# Altium project apogee_detection_board.PrjPcb
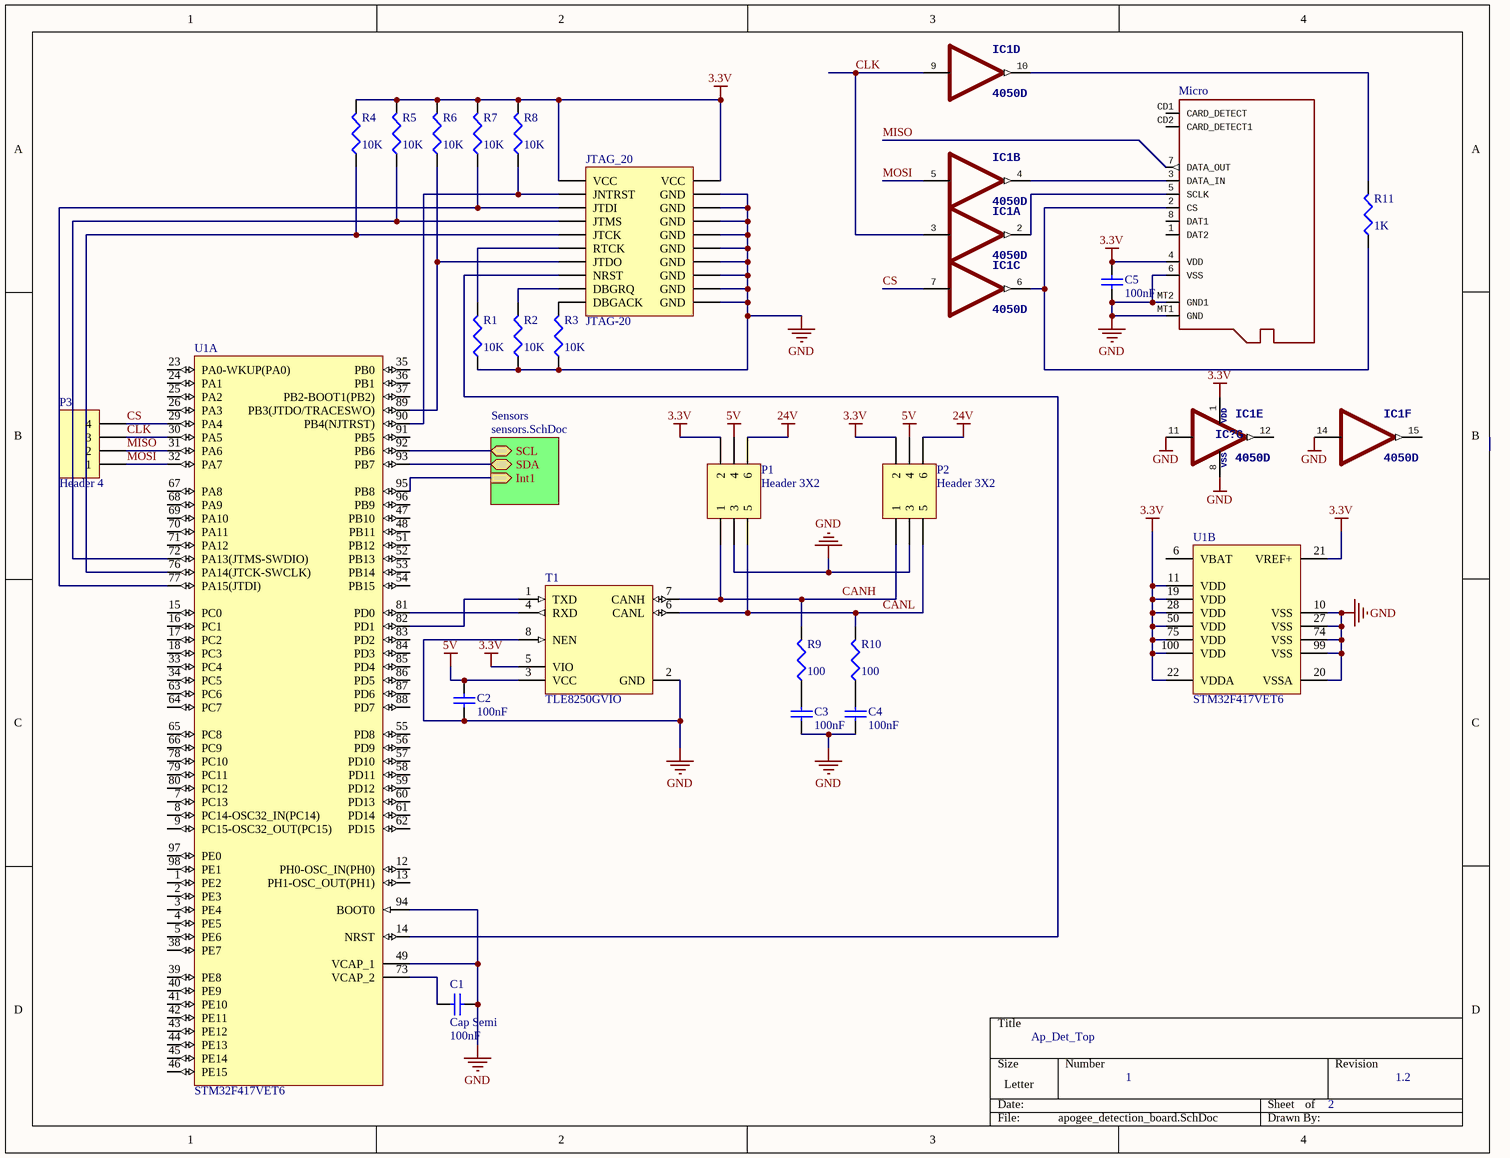
[diagram p0: apogee_detection_board.SchDoc]
2 sheets, 30 parts. Net scope: hierarchical (ports join the sheet entries above them; power ports are global).
Board file: ApDet.PcbDoc
Sheets:
  apogee_detection_board.SchDoc
    Sensors = sensors.SchDoc

## Sheet apogee_detection_board.SchDoc: Ap_Det_Top
size Letter; Revision: 1.2; SheetNumber: 1; SheetTotal: 2; ProjectName: Apogee_Detect

### Parts
C1  Cap Semi  value 100nF  [C1206]
C2  value 100nF  [C1206]  (hidden comment: Cap Semi)
C3  value 100nF  [C1206]  (hidden comment: Cap Semi)
C4  value 100nF  [C1206]  (hidden comment: Cap Semi)
C5  value 100nF  [C1206]  (hidden comment: Cap Semi)
IC1  4050D  [SO16]  (parts A,B,C,D,E,F of 7)
IC?  4050D  [SO16]  (part G of 7)
JTAG_20  JTAG-20  [PCBComponent_1]
Micro  (no value)  [MICROSD]
P1  Header 3X2  [HDR2X3]
P2  Header 3X2  [HDR2X3]
P3  Header 4  [HDR1X4]
R1  value 10K  [J1-0603]  (hidden comment: RTCK PD)
R2  value 10K  [J1-0603]  (hidden comment: DBGRQ PD)
R3  value 10K  [J1-0603]  (hidden comment: DBGACK PD)
R4  value 10K  [J1-0603]  (hidden comment: RTCK PD)
R5  value 10K  [J1-0603]  (hidden comment: RTCK PD)
R6  value 10K  [J1-0603]  (hidden comment: RTCK PD)
R7  value 10K  [J1-0603]  (hidden comment: RTCK PD)
R8  value 10K  [J1-0603]  (hidden comment: RTCK PD)
R9  value 100  [J1-0603]  (hidden comment: DBGACK PD)
R10  value 100  [J1-0603]  (hidden comment: DBGACK PD)
R11  value 1K  [J1-0603]  (hidden comment: DBGRQ PD)
T1  TLE8250GVIO  [INF-PG-DSO-8-16_N]
U1  STM32F417VET6  [STM-LQFP100_N]  (parts A,B of 2)

### Sub-sheets
Sensors = sensors.SchDoc: SCL (bidir), SDA (bidir), Int1 (in)

### Nets
3.3V: C5.2 IC?.1(VDD) JTAG_20.1(VCC) JTAG_20.2(VCC) Micro.4(VDD) P1.2 P2.2 R4.2 R5.2 R6.2 R7.2 R8.2 T1.5(VIO) U1.11(VDD) U1.19(VDD) U1.21(VREF+) U1.22(VDDA) U1.28(VDD) U1.50(VDD) U1.75(VDD) U1.100(VDD)
5V: C2.2 P1.4 P2.4 T1.3(VCC)
24V: P1.6 P2.6
GND: C1.2 C2.1 C3.1 C4.1 C5.1 IC1.11(I) IC1.14(I) IC?.8(VSS) JTAG_20.4(GND) JTAG_20.6(GND) JTAG_20.8(GND) JTAG_20.10(GND) JTAG_20.12(GND) JTAG_20.14(GND) JTAG_20.16(GND) JTAG_20.18(GND) JTAG_20.20(GND) Micro.6(VSS) Micro.MT1(GND) Micro.MT2(GND1) P1.3 P2.3 R1.1 R2.1 R3.1 T1.2(GND) T1.8(NEN) U1.10(VSS) U1.20(VSSA) U1.27(VSS) U1.49(VCAP_1) U1.74(VSS) U1.94(BOOT0) U1.99(VSS)
CANH: P1.1 P2.1 R9.2 T1.7(CANH)
CANL: P1.5 P2.5 R10.2 T1.6(CANL)
CLK: IC1.3(I) IC1.9(I) P3.3 U1.30(PA5)
CS: IC1.7(I) P3.4 U1.29(PA4)
MISO: Micro.7(DATA_OUT) P3.2 U1.31(PA6)
MOSI: IC1.5(I) P3.1 U1.32(PA7)
SCL: U1.92(PB6) ; sheet Sensors/SCL
SDA: U1.93(PB7) ; sheet Sensors/SDA
NetA1_11: U1.95(PB8) ; sheet Sensors/Int1
NetC1_1: C1.1 U1.73(VCAP_2)
NetC3_2: C3.2 R9.1
NetC4_2: C4.2 R10.1
NetIC1_2: IC1.2(O) Micro.5(SCLK)
NetIC1_4: IC1.4(O) Micro.3(DATA_IN)
NetIC1_6: IC1.6(O) Micro.2(CS) R11.1
NetIC1_10: IC1.10(O) R11.2
NetJTAG_20_3: JTAG_20.3(JNTRST) R8.1 U1.90(PB4(NJTRST))
NetJTAG_20_5: JTAG_20.5(JTDI) R7.1 U1.77(PA15(JTDI))
NetJTAG_20_7: JTAG_20.7(JTMS) R5.1 U1.72(PA13(JTMS-SWDIO))
NetJTAG_20_9: JTAG_20.9(JTCK) R4.1 U1.76(PA14(JTCK-SWCLK))
NetJTAG_20_11: JTAG_20.11(RTCK) R1.2
NetJTAG_20_13: JTAG_20.13(JTDO) R6.1 U1.89(PB3(JTDO/TRACESWO))
NetJTAG_20_15: JTAG_20.15(NRST) U1.14(NRST)
NetJTAG_20_17: JTAG_20.17(DBGRQ) R2.2
NetJTAG_20_19: JTAG_20.19(DBGACK) R3.2
NetT1_1: T1.1(TXD) U1.82(PD1)
NetT1_4: T1.4(RXD) U1.81(PD0)

Not connected (* = marked no-connect by the designer): IC1 12(O) 15(O); Micro 1(DAT2) 8(DAT1) CD1(CARD_DETECT) CD2(CARD_DETECT1); U1 1(PE2) 2(PE3) 3(PE4) 4(PE5) 5(PE6) 6(VBAT) 7(PC13) 8(PC14-OSC32_IN(PC14)) 9(PC15-OSC32_OUT(PC15)) 12(PH0-OSC_IN(PH0)) 13(PH1-OSC_OUT(PH1)) 15(PC0) 16(PC1) 17(PC2) 18(PC3) 23(PA0-WKUP(PA0)) 24(PA1) 25(PA2) 26(PA3) 33(PC4) 34(PC5) 35(PB0) 36(PB1) 37(PB2-BOOT1(PB2)) 38(PE7) 39(PE8) 40(PE9) 41(PE10) 42(PE11) 43(PE12) 44(PE13) 45(PE14) 46(PE15) 47(PB10) 48(PB11) 51(PB12) 52(PB13) 53(PB14) 54(PB15) 55(PD8) 56(PD9) 57(PD10) 58(PD11) 59(PD12) 60(PD13) 61(PD14) 62(PD15) 63(PC6) 64(PC7) 65(PC8) 66(PC9) 67(PA8) 68(PA9) 69(PA10) 70(PA11) 71(PA12) 78(PC10) 79(PC11) 80(PC12) 83(PD2) 84(PD3) 85(PD4) 86(PD5) 87(PD6) 88(PD7) 91(PB5) 96(PB9) 97(PE0) 98(PE1)

### Library data of the parts
C1-C5 = Cap Semi: Capacitor (Semiconductor SIM Model); Published: 8-Jun-2000; LatestRevisionDate: 29-May-2009; LatestRevisionNote: IPC-7351 Footprint Added.; PackageReference: C1206; Publisher: Altium Limited; PackageDescription: Chip Capacitor
IC1 IC? = 4050D: Hex non-inverting BUFFER
  IC?: VDD: VDD; VSS: VSS
JTAG_20 = HEADER 10X2: 20-pin JTAG header
Micro = MICROSD
P1 P2 = Header 3X2: Header, 3-Pin, Dual row; LatestRevisionDate: 17-Jul-2002; LatestRevisionNote: Re-released for DXP Platform.; Publisher: Altium Limited
P3 = Header 4: Header, 4-Pin; LatestRevisionDate: 17-Jul-2002; LatestRevisionNote: Re-released for DXP Platform.; Publisher: Altium Limited
R1-R11 = Res3: Resistor; Published: 8-Jun-2000; LatestRevisionDate: 29-May-2009; LatestRevisionNote: IPC-7351 Footprint Added.; PackageReference: J1-0603; Publisher: Altium Limited; PackageDescription: Chip Resistor
T1 = TLE8250GVIO: High Speed CAN-Transceiver, 1 Mbit/s Transmission Rate, PG-DSO-8-16, Reel, Green; Manufacturer: Infineon; Bus Wake-up capability: FALSE; Green: TRUE; Quiescent Current (max.): < 15 uA @ 5V standby; Standards: ISO11898-2; Wake-up inputs: no; DatasheetVersion: Rev. 1.0; PackageVersion: Mar-07; PackageReference: PG-DSO-8-16; PackageDescription: 8-Pin Plastic (Green) Dual Small Outline Package, 4.9 x 3.9 mm Body, 1.27 mm Pitch; Supplier 1: Mouser; Supplier Part Number 1: 726-TLE8250GVIO; Supplier 2: Digi-Key; Supplier Part Number 2: TLE8250GVIO-ND; Group: High Speed; Halogen-free: TRUE; Packing: Reel; Transmission rate max: 1 Mbit/s; Mounting Technology: Surface Mount; PartNumber: TLE8250GVIO; ComponentLink1Description: Manufacturer URL; ComponentLink1URL: http://www.infineon.com/; ComponentLink2Description: Datasheet; ComponentLink2URL: http://www.infineon.com/dgdl/TLE8250GVIO_DS_Rev10.pdf?folderId=db3a30431ed1d7b2011edadb13813703&fileId=db3a30432b57a660012b67ea91880b46&location=en.Products.Automotive_ICs.Automotive_Transceivers.CAN_Transceivers.DATASHEET.TLE8250GVIO_DS_Rev10.pdf; ComponentLink3Description: Package Specification; ComponentLink3URL: http://www.infineon.com/dgdl/TLE7259-2GE_DS_rev12.pdf?folderId=db3a3043163797a6011666d32a0c0de1&fileId=db3a3043163797a6011666d4dbb80de2&location=en.Products.Automotive_ICs.Automotive_Transceivers.LIN_Transceivers.DATASHEET.TLE7259-2GE_DS_rev12.pdf
U1 = STM32F417VET6: ARM Cortex-M4 32-bit MCU+FPU, 210 DMIPS, 512 kB Flash, 192 kB Internal RAM, 82 I/Os, 100-pin LQFP, -40 to 85 degC, Tray; Manufacturer: STMicroelectronics; D/A Converter: 2x12-bit; FLASH Size (Prog) (kB): 512; I/Os (High Current): 82; Internal RAM Size (kB): 192; Operating Frequency(F) (Processor speed) (MHz): 168; Supply Voltage(Vcc) max (V): 3.6; Supply Voltage(Vcc) min (V): 1.8; DatasheetVersion: Rev. 4; PackageVersion: Rev. 1, 06/2013; PackageReference: LQFP100; PackageDescription: 100-Pin Low Profile Quad Flat Package, 14 x 14 mm Body, 0.5 mm Pitch; Supplier 1: Digi-Key; Supplier Part Number 1: 497-11901-ND; Supplier 2: Farnell; Supplier Part Number 2: 2333307; Supplier 3: Newark; Supplier Part Number 3: 99W9922; Supplier 4: Newark; Supplier Part Number 4: 94T6496; Supplier 5: Mouser; Supplier Part Number 5: 511-STM32F417VET6; Core: ARM Cortex-M4; Packing: Tray; Mounting Technology: Surface Mount; PartNumber: STM32F417VET6; ComponentLink1Description: Manufacturer URL; ComponentLink1URL: http://www.st.com/web/en/home.html; ComponentLink2Description: Datasheet; ComponentLink2URL: http://www.st.com/st-web-ui/static/active/en/resource/technical/document/datasheet/DM00035129.pdf; ComponentLink3Description: Package Specification; ComponentLink3URL: http://www.st.com/st-web-ui/static/active/en/resource/technical/document/data_brief/DM00071938.pdf

## Sheet sensors.SchDoc: Ap_Det_Sensors
size A; Revision: 1.2; SheetNumber: 2; SheetTotal: 2
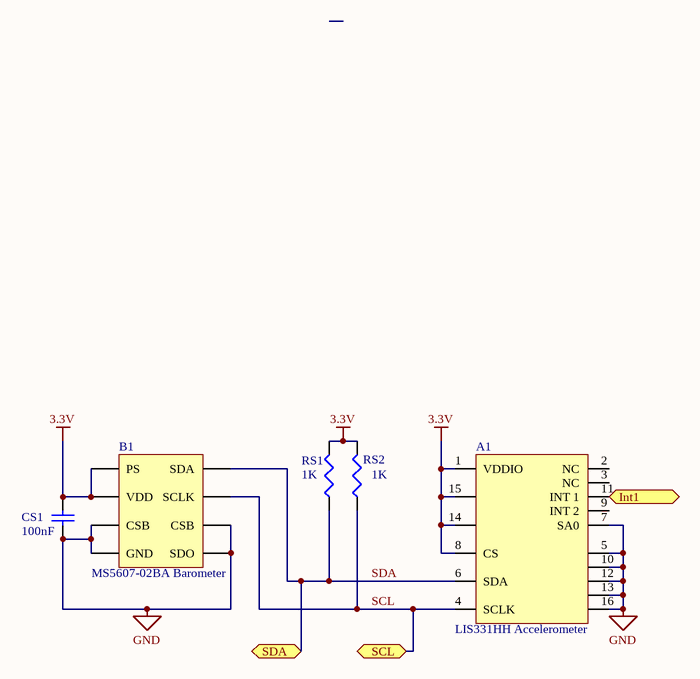
[diagram p1: sensors.SchDoc]

### Parts
A1  LIS331HH Accelerometer  [LGA16]
B1  MS5607-02BA Barometer  [Barometer LCC]
CS1  value 100nF  [C1206]  (hidden comment: Cap Semi)
RS1  value 1K  [J1-0603]  (hidden comment: Res3)
RS2  value 1K  [J1-0603]  (hidden comment: Res3)

### Ports
Int1, SCL, SDA

### Nets
3.3V: A1.1(VDDIO) A1.8(CS) A1.14 A1.15 B1.1(VDD) B1.2(PS) CS1.2 RS1.2 RS2.2
GND: A1.5(GND) A1.7(SA0) A1.10 A1.12 A1.13 A1.16 B1.3(GND) B1.4(CSB) B1.5(CSB) B1.6(SDO) CS1.1
SCL: A1.4(SCLK) B1.8(SCLK) RS2.1 ; port SCL
SDA: A1.6(SDA) B1.7(SDA) RS1.1 ; port SDA
NetA1_11: A1.11(INT_1) ; port Int1

Not connected (* = marked no-connect by the designer): A1 2(NC) 3(NC) 9(INT_2)

### Library data of the parts
CS1 = Cap Semi: Capacitor (Semiconductor SIM Model); Published: 8-Jun-2000; LatestRevisionDate: 29-May-2009; LatestRevisionNote: IPC-7351 Footprint Added.; PackageReference: C1206; Publisher: Altium Limited; PackageDescription: Chip Capacitor
RS1 RS2 = Res3: Resistor; Published: 8-Jun-2000; LatestRevisionDate: 29-May-2009; LatestRevisionNote: IPC-7351 Footprint Added.; PackageReference: J1-0603; Publisher: Altium Limited; PackageDescription: Chip Resistor

## Nets that join several sheets
3.3V: apogee_detection_board (21 pins), sensors (9 pins)
GND: apogee_detection_board (34 pins), sensors (11 pins)
NetA1_11: apogee_detection_board (U1.95), sensors (A1.11)
SCL: apogee_detection_board (U1.92), sensors (A1.4 B1.8 RS2.1)
SDA: apogee_detection_board (U1.93), sensors (A1.6 B1.7 RS1.1)